# EAGLE design ReadySetNerds (EAGLE 9.6.2)
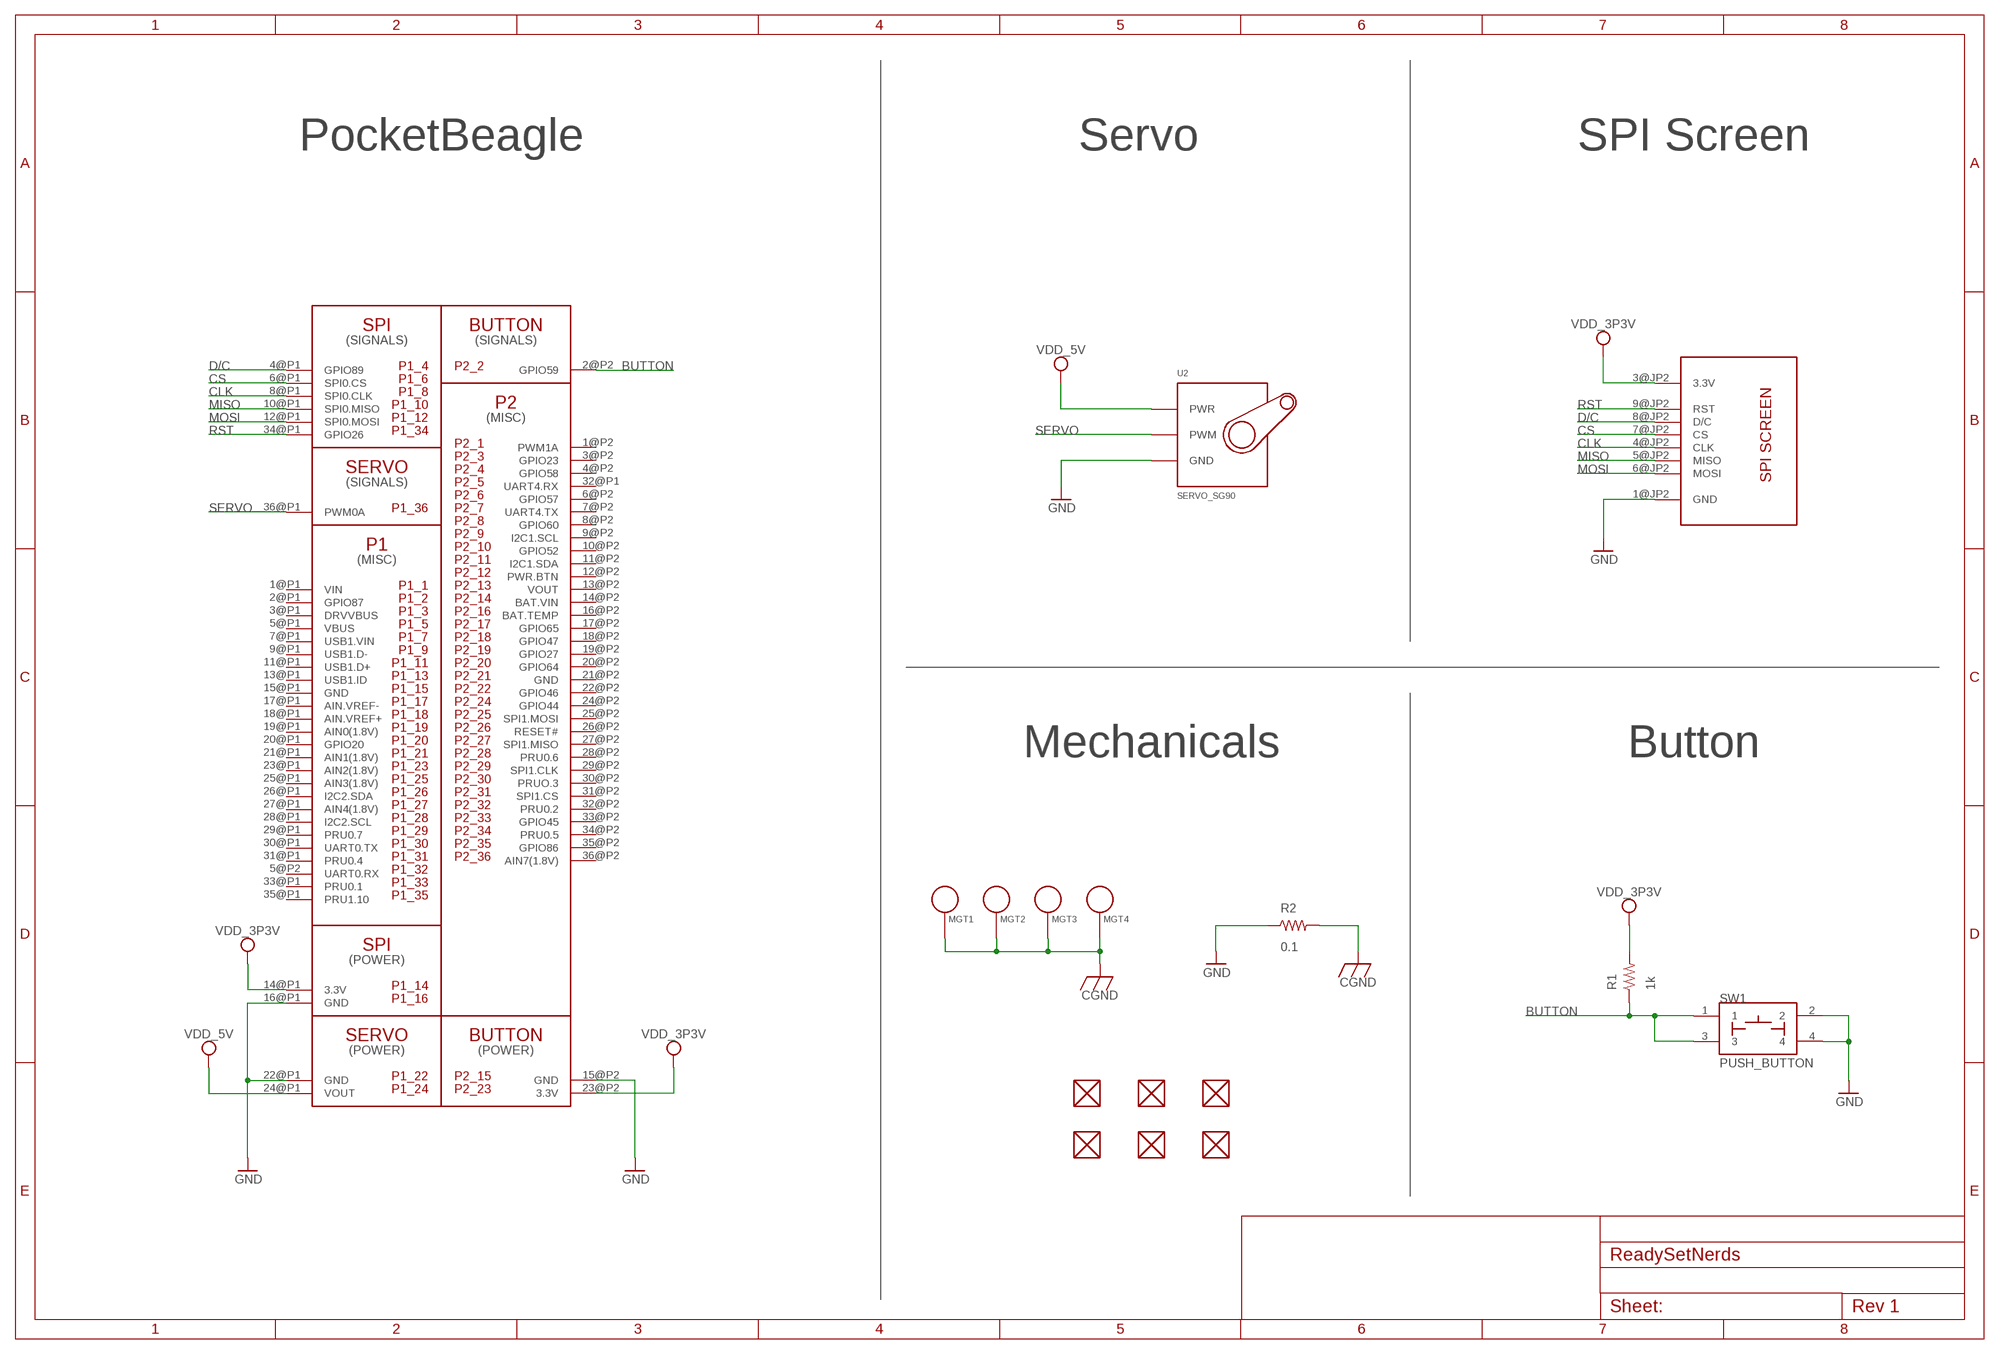
[diagram p0: schematic, sheet 1]

## Parts
FUD1  FIDUCIAL  [FIDUCIAL_40MIL]
FUD2  FIDUCIAL  [FIDUCIAL_40MIL]
FUD3  FIDUCIAL  [FIDUCIAL_40MIL]
FUD4  FIDUCIAL  [FIDUCIAL_40MIL]
FUD5  FIDUCIAL  [FIDUCIAL_40MIL]
FUD6  FIDUCIAL  [FIDUCIAL_40MIL]
MGT1  MOUNTING_HOLE  [MOUNTING_HOLE]
MGT2  MOUNTING_HOLE  [MOUNTING_HOLE]
MGT3  MOUNTING_HOLE  [MOUNTING_HOLE]
MGT4  MOUNTING_HOLE  [MOUNTING_HOLE]
R1  1k  R_R0603  [R0603]
R2  0.1  R_R0603  [R0603]
SW1  PUSH_BUTTON  [BUTTON_12.5MM]
U2  SERVO_SG90  [SERVO-X1]
U$1  POCKETBEAGLE  [POCKETBEAGLE]
U$2  SPISCREEN  [SPISCREEN]

## Nets
BUTTON: R1.1 SW1.1 SW1.3 U$1.2@P2(GPIO59)
CGND: MGT1.P$1 MGT2.P$1 MGT3.P$1 MGT4.P$1 R2.2
CLK: U$1.8@P1(SPI0.CLK) U$2.4@JP2(CLK)
CS: U$1.6@P1(SPI0.CS) U$2.7@JP2(CS)
D/C: U$1.4@P1(GPIO89) U$2.8@JP2(D/C)
GND: R2.1 SW1.2 SW1.4 U2.GND U$1.15@P2(GND) U$1.16@P1(GND) U$1.22@P1(GND) U$2.1@JP2(GND)
MISO: U$1.10@P1(SPI0.MISO) U$2.5@JP2(MISO)
MOSI: U$1.12@P1(SPI0.MOSI) U$2.6@JP2(MOSI)
RST: U$1.34@P1(GPIO26) U$2.9@JP2(RST)
SERVO: U2.SIG(PWM) U$1.36@P1(PWM0A)
VDD_3P3V: R1.2 U$1.14@P1(3.3V) U$1.23@P2(3.3V) U$2.3@JP2(3.3V)
VDD_5V: U2.PWR U$1.24@P1(VOUT)
Unconnected: FUD1.P$1 FUD2.P$1 FUD3.P$1 FUD4.P$1 FUD5.P$1 FUD6.P$1 U$1.1@P1(VIN) U$1.1@P2(PWM1A) U$1.2@P1(GPIO87) U$1.3@P1(DRVVBUS) U$1.3@P2(GPIO23) U$1.4@P2(GPIO58) U$1.5@P1(VBUS) U$1.5@P2(UART0.RX) U$1.6@P2(GPIO57) U$1.7@P1(USB1.VIN) U$1.7@P2(UART4.TX) U$1.8@P2(GPIO60) U$1.9@P1(USB1.D-) U$1.9@P2(I2C1.SCL) U$1.10@P2(GPIO52) U$1.11@P1(USB1.D+) U$1.11@P2(I2C1.SDA) U$1.12@P2(PWR.BTN) U$1.13@P1(USB1.ID) U$1.13@P2(VOUT) U$1.14@P2(BAT.VIN) U$1.15@P1(GND) U$1.16@P2(BAT.TEMP) U$1.17@P1(AIN.VREF-) U$1.17@P2(GPIO65) U$1.18@P1(AIN.VREF+) U$1.18@P2(GPIO47) U$1.19@P1(AIN0(1.8V)) U$1.19@P2(GPIO27) U$1.20@P1(GPIO20) U$1.20@P2(GPIO64) U$1.21@P1(AIN1(1.8V)) U$1.21@P2(GND) U$1.22@P2(GPIO46) U$1.23@P1(AIN2(1.8V)) U$1.24@P2(GPIO44) U$1.25@P1(AIN3(1.8V)) U$1.25@P2(SPI1.MOSI) U$1.26@P1(I2C2.SDA) U$1.26@P2(RESET#) U$1.27@P1(AIN4(1.8V)) U$1.27@P2(SPI1.MISO) U$1.28@P1(I2C2.SCL) U$1.28@P2(PRU0.6) U$1.29@P1(PRU0.7) U$1.29@P2(SPI1.CLK) U$1.30@P1(UART0.TX) U$1.30@P2(PRUO.3) U$1.31@P1(PRU0.4) U$1.31@P2(SPI1.CS) U$1.32@P1(UART4.RX) U$1.32@P2(PRU0.2) U$1.33@P1(PRU0.1) U$1.33@P2(GPIO45) U$1.34@P2(PRU0.5) U$1.35@P1(PRU1.10) U$1.35@P2(GPIO86) U$1.36@P2(AIN7(1.8V))

## Notes on the sheet
- PocketBeagle | Servo | SPI Screen
- Mechanicals | Button

## Library data of the parts
FUD1-FUD6 = ReadySetNerds:FIDUCIAL
MGT1-MGT4 = ReadySetNerds:MOUNTING_HOLE: Chassis Mounting Hole w/GND connection ability
R1 R2 = ReadySetNerds:R_: RESISTOR, American symbol
SW1 = ReadySetNerds:PUSH_BUTTON
U2 = ReadySetNerds:SERVO_SG90
U$1 = ReadySetNerds:POCKETBEAGLE
U$2 = ReadySetNerds:SPISCREEN

## Board
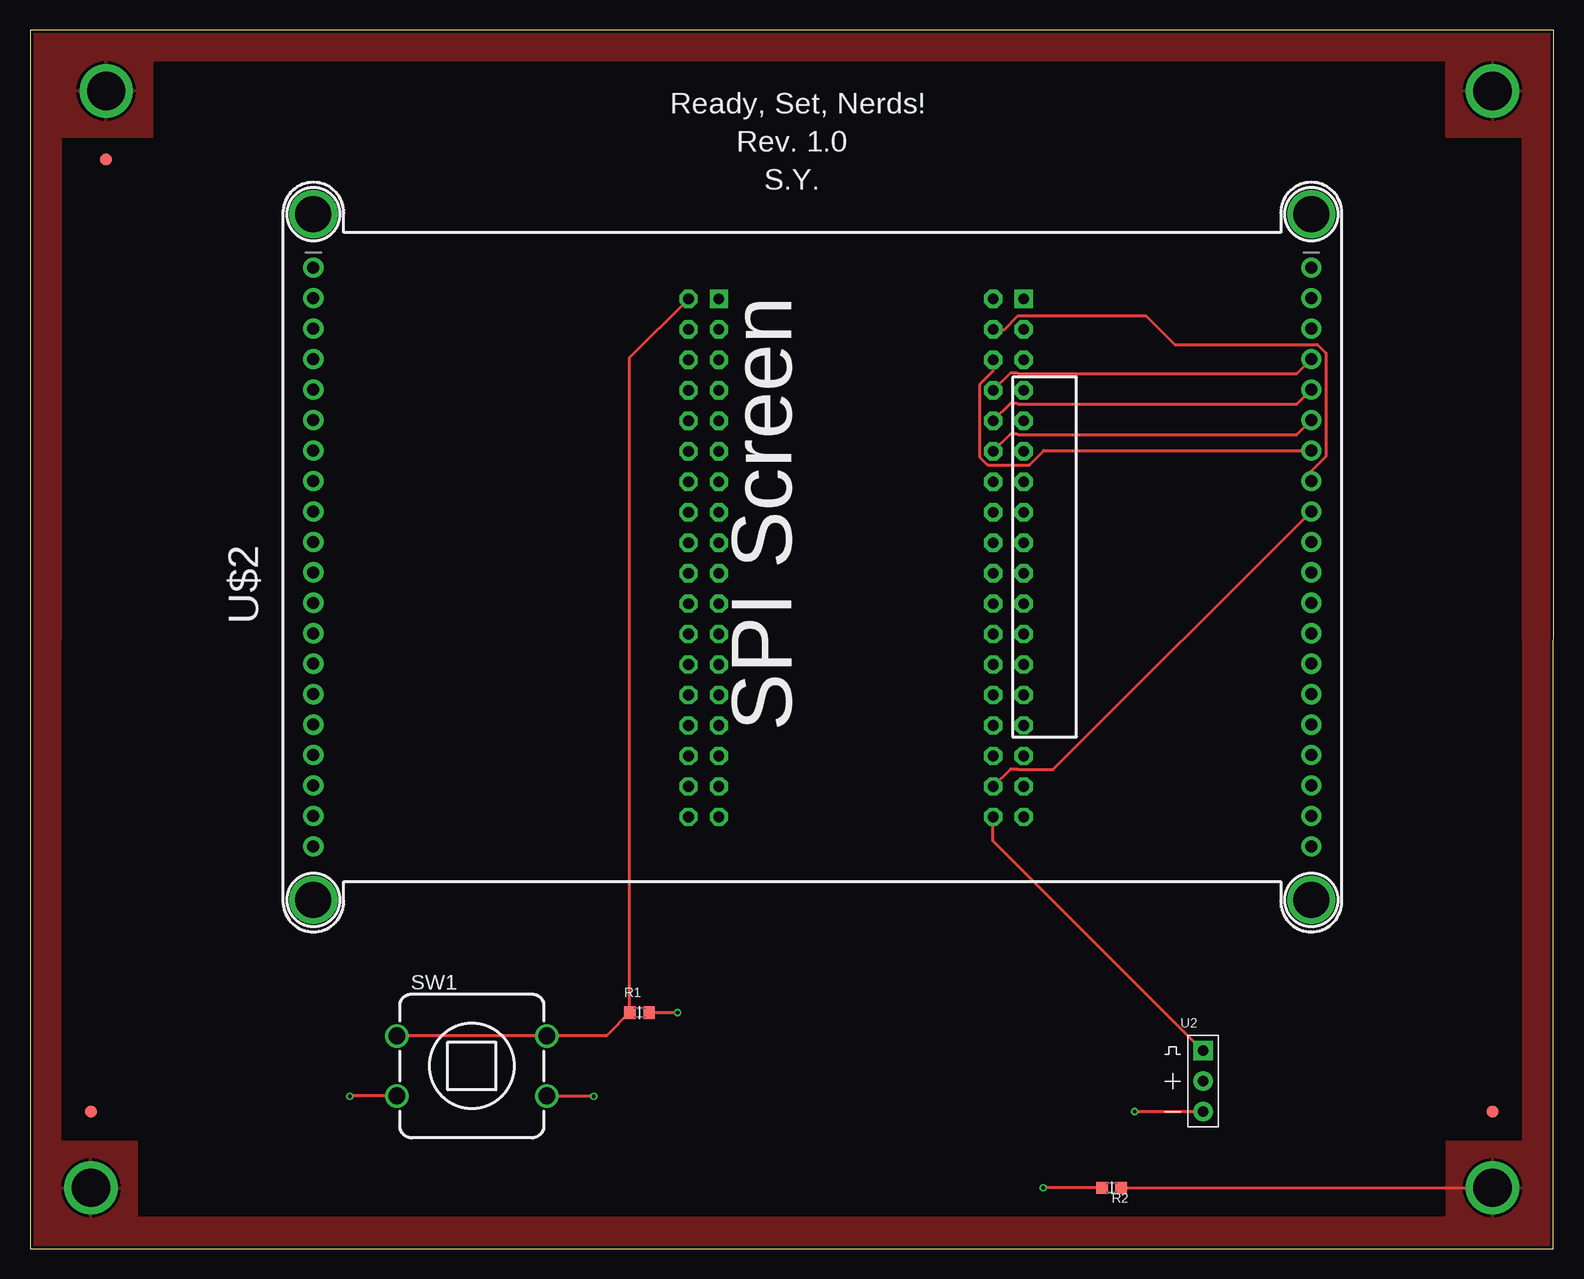
[diagram p1: board, top side]
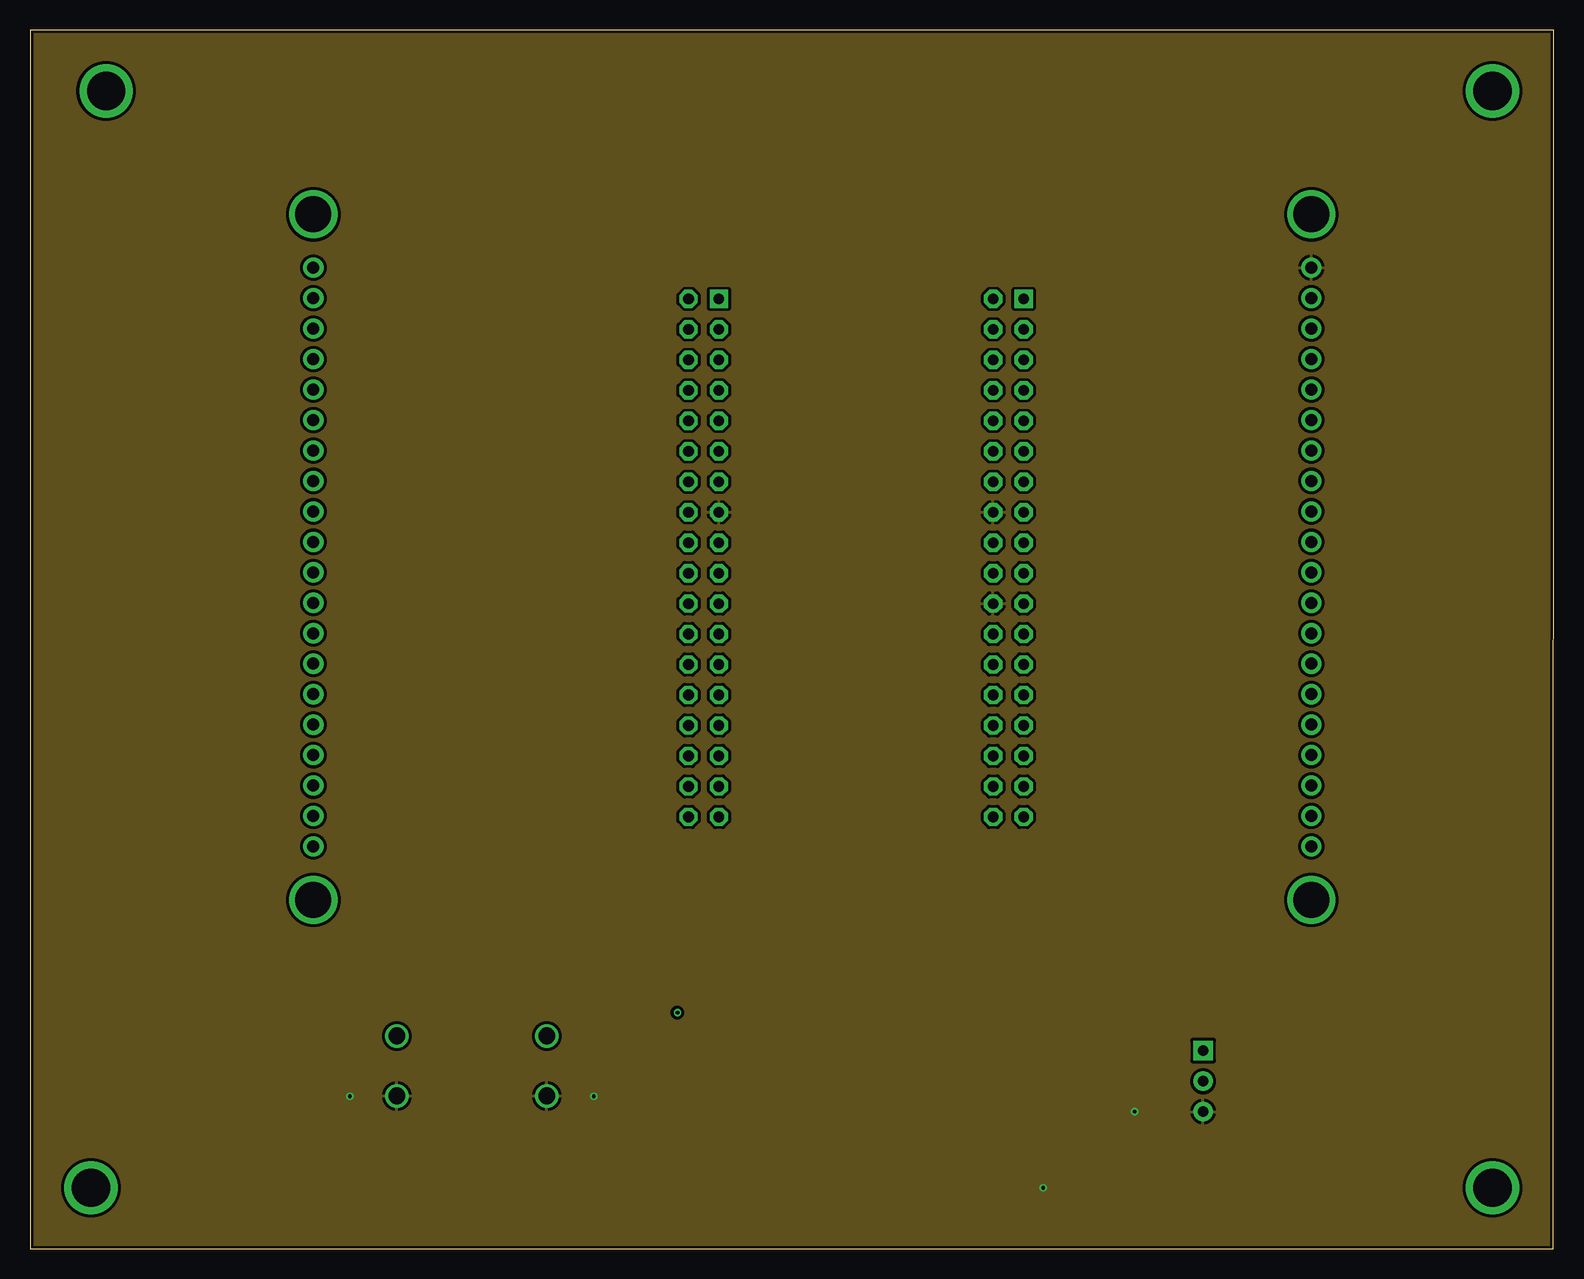
[diagram p2: board, inner layer Route2]
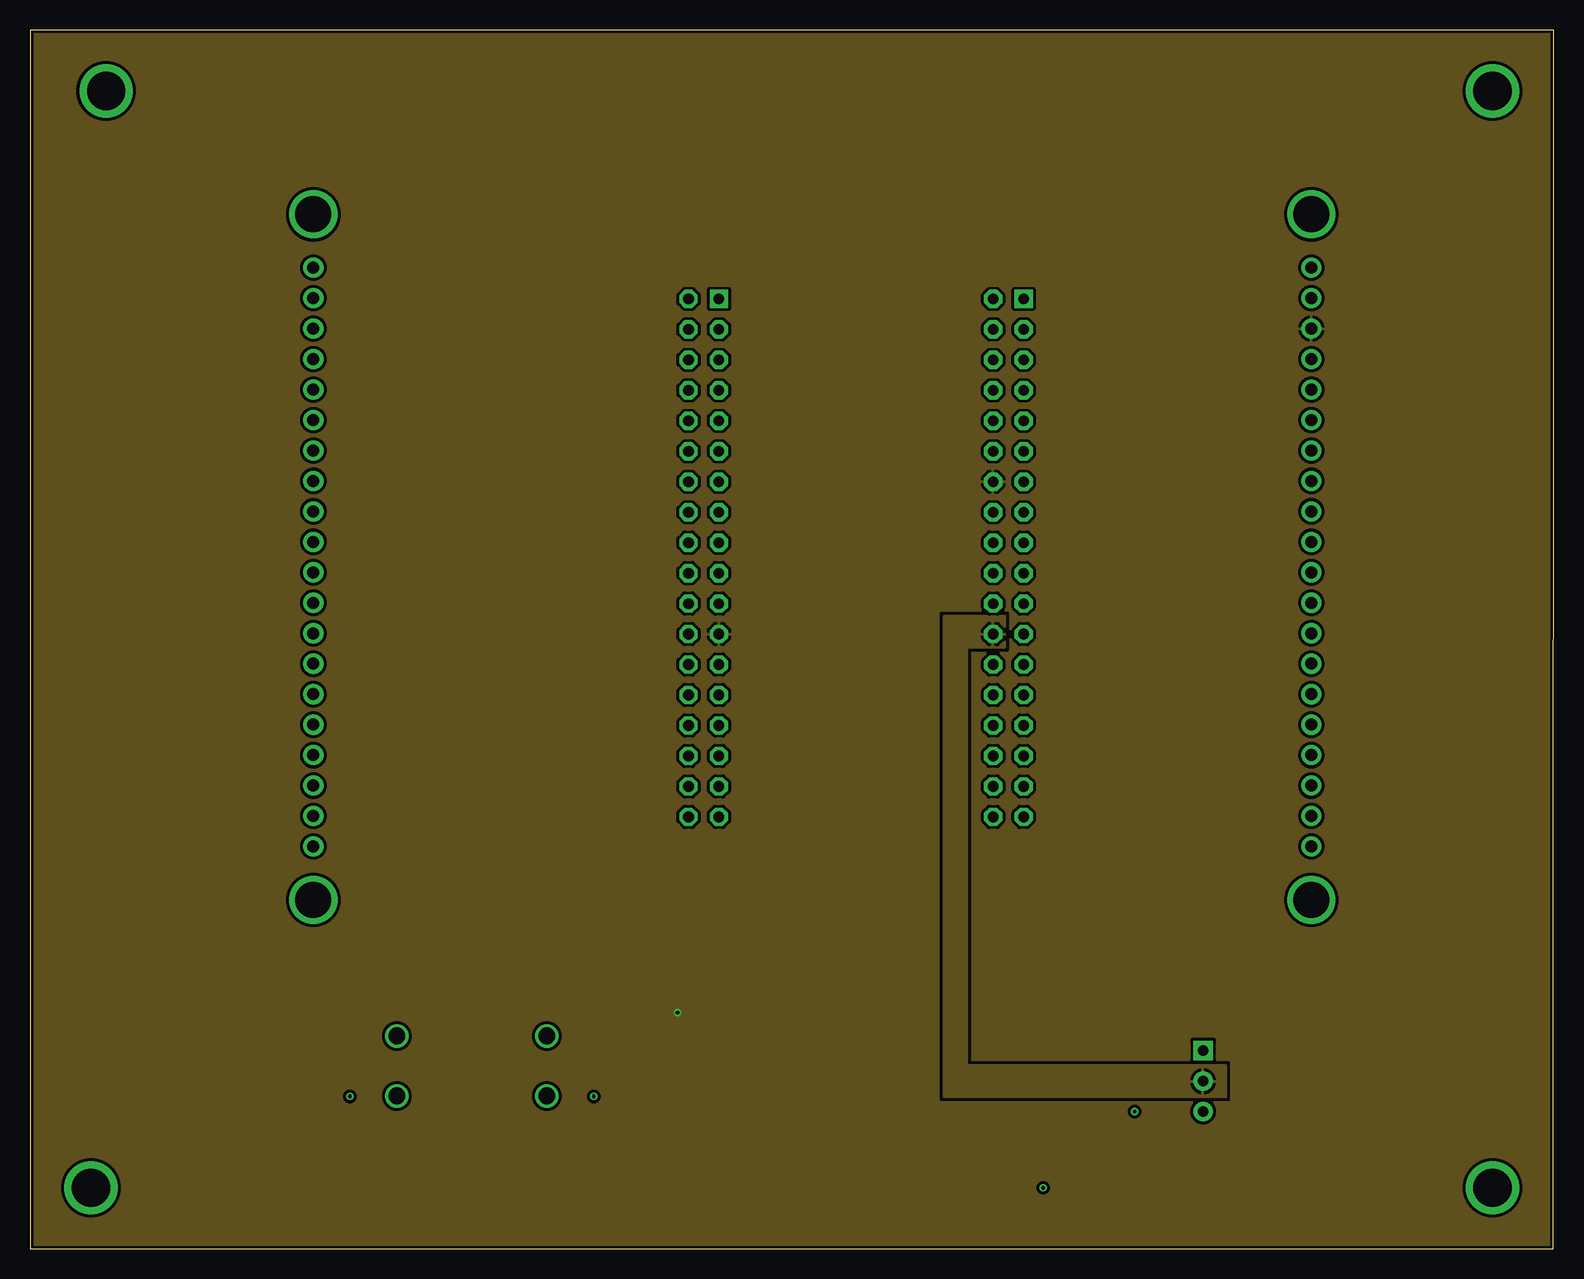
[diagram p3: board, inner layer Route15]
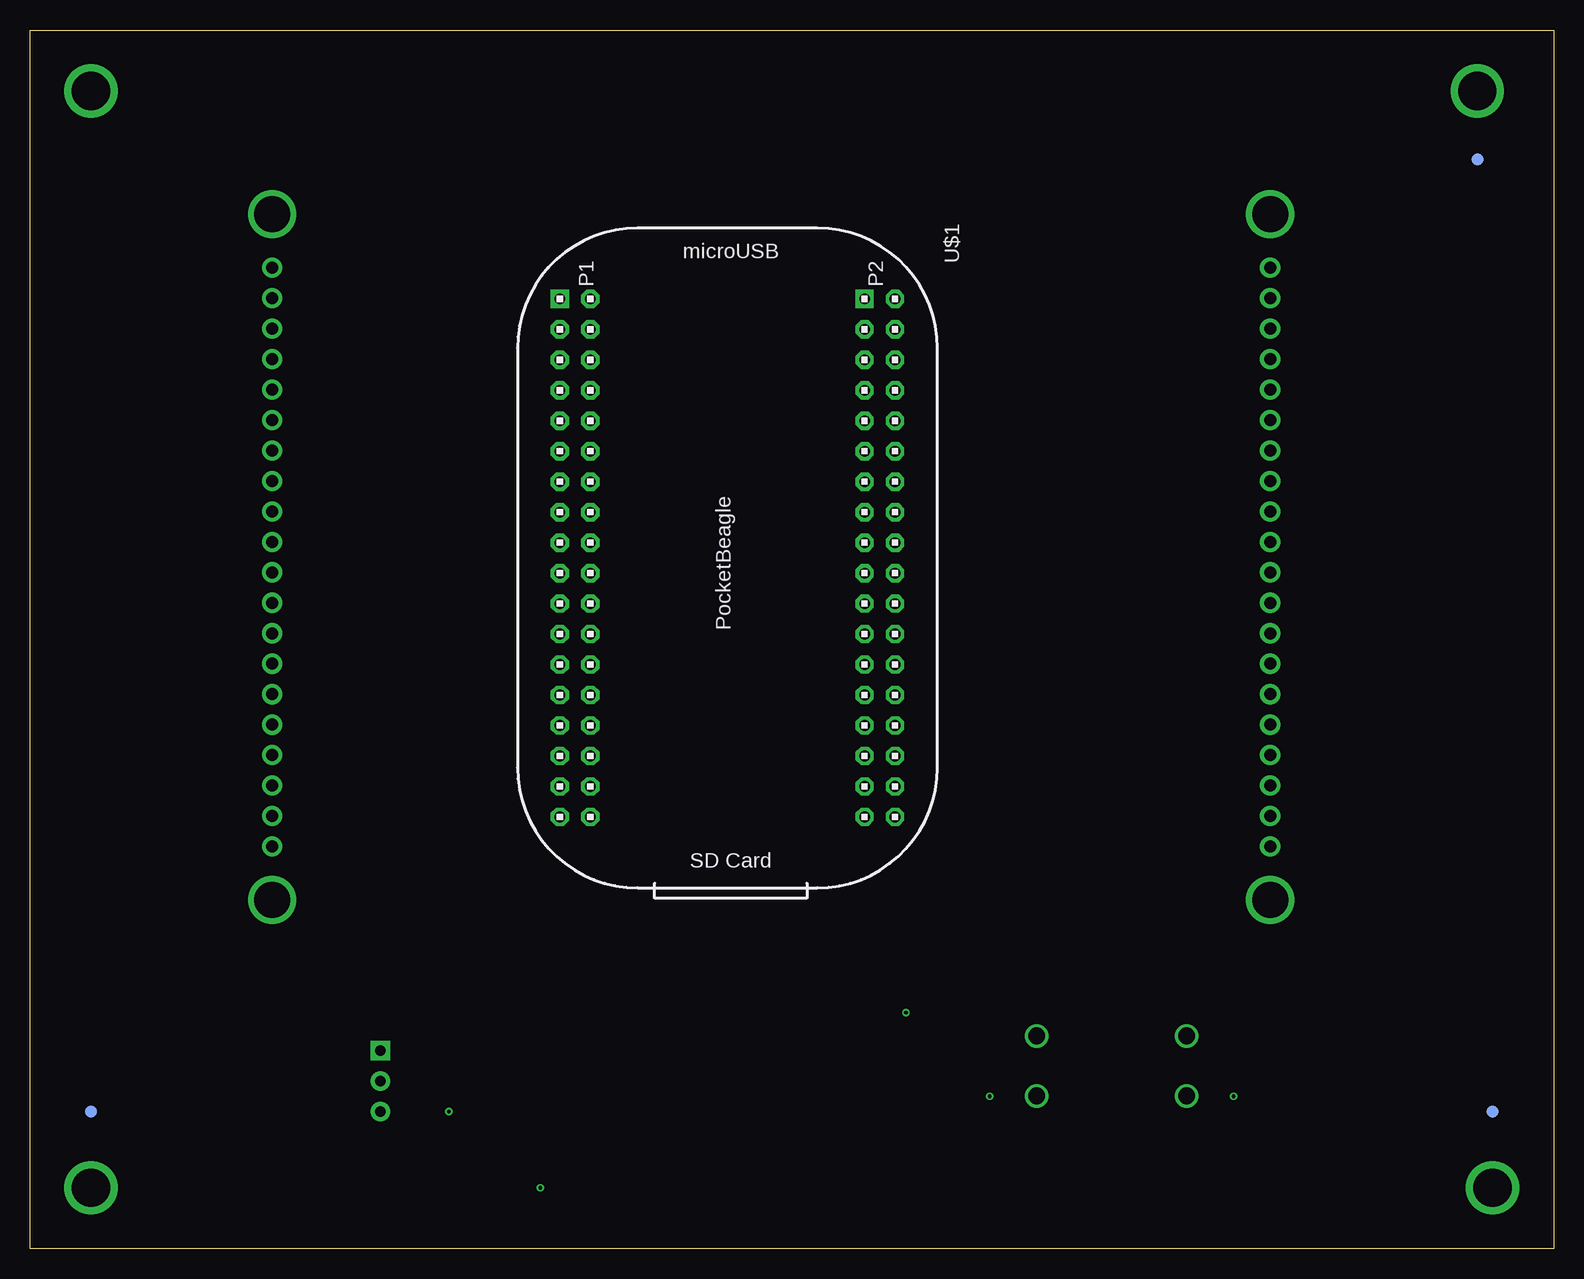
[diagram p4: board, bottom side, seen from below]

Size 127 x 101.6 mm. Coordinates in mm from the lower left corner, seen from the top.
Outline: 0,0 126.98,0 127,101.6 0,101.6 0,0
Copper layers (1*2*15*16): Top 0.035mm / dielectric 0.23mm / Route2 0.035mm / dielectric 0.93mm / Route15 0.035mm / dielectric 0.23mm / Bottom 0.035mm
Design rules "default *": minimum track width 10mil, minimum drill 12mil, track to track 10mil, track to pad 10mil, pad to pad 10mil, via to via 10mil, smd to smd 10mil, copper to edge 10mil, drill to drill 12mil, minimum pad ring 6mil, minimum via ring 6mil, stop-mask expansion 3mil, vias tented up to drill 25mil, thermal gap 10mil

### Footprints (pad centres in the part's own frame; a part is rotated, then mirrored left to right if it is on the bottom)
FIDUCIAL_40MIL = smd 1.016 x 1.016: P$1 0,0
MOUNTING_HOLE = drill 3.175 pad 4.445: P$1 0,0
R0603 = smd 0.95 x 1.031: 1 -0.8,0; 2 0.8,0
BUTTON_12.5MM = drill 1.4: 1 -6.25,2.5; 2 -6.25,-2.5; 3 6.25,2.5; 4 6.25,-2.5
SERVO-X1 = drill 0.889 pad 1.651: GND 0,-2.54; PWR 0,0 | drill 0.889 pad 1.651 square: SIG 0,2.54
POCKETBEAGLE = drill 0.889 pad 1.524 square: 1@P1 10.99,9.88; 1@P2 10.99,35.28 | drill 0.889 pad 1.524 octagon: 2@P1 10.99,12.42; 2@P2 10.99,37.82; 3@P1 13.53,9.88; 3@P2 13.53,35.28; 4@P1 13.53,12.42; 4@P2 13.53,37.82; 5@P1 16.07,9.88; 5@P2 16.07,35.28; 6@P1 16.07,12.42; 6@P2 16.07,37.82; 7@P1 18.61,9.88; 7@P2 18.61,35.28; 8@P1 18.61,12.42; 8@P2 18.61,37.82; 9@P1 21.15,9.88; 9@P2 21.15,35.28; 10@P1 21.15,12.42; 10@P2 21.15,37.82; 11@P1 23.69,9.88; 11@P2 23.69,35.28; 12@P1 23.69,12.42; 12@P2 23.69,37.82; 13@P1 26.23,9.88; 13@P2 26.23,35.28; 14@P1 26.23,12.42; 14@P2 26.23,37.82; 15@P1 28.77,9.88; 15@P2 28.77,35.28; 16@P1 28.77,12.42; 16@P2 28.77,37.82; 17@P1 31.31,9.88; 17@P2 31.31,35.28; 18@P1 31.31,12.42; 18@P2 31.31,37.82; 19@P1 33.85,9.88; 19@P2 33.85,35.28; 20@P1 33.85,12.42; 20@P2 33.85,37.82; 21@P1 36.39,9.88; 21@P2 36.39,35.28; 22@P1 36.39,12.42; 22@P2 36.39,37.82; 23@P1 38.93,9.88; 23@P2 38.93,35.28; 24@P1 38.93,12.42; 24@P2 38.93,37.82; 25@P1 41.47,9.88; 25@P2 41.47,35.28; 26@P1 41.47,12.42; 26@P2 41.47,37.82; 27@P1 44.01,9.88; 27@P2 44.01,35.28; 28@P1 44.01,12.42; 28@P2 44.01,37.82; 29@P1 46.55,9.88; 29@P2 46.55,35.28; 30@P1 46.55,12.42; 30@P2 46.55,37.82; 31@P1 49.09,9.88; 31@P2 49.09,35.28; 32@P1 49.09,12.42; 32@P2 49.09,37.82; 33@P1 51.63,9.88; 33@P2 51.63,35.28; 34@P1 51.63,12.42; 34@P2 51.63,37.82; 35@P1 54.17,9.88; 35@P2 54.17,35.28; 36@P1 54.17,12.42; 36@P2 54.17,37.82
SPISCREEN = drill 1 pad 1.676: 1@JP1 36.068,50.038; 1@JP2 36.068,-33.147; 2@JP1 33.528,50.038; 2@JP2 33.528,-33.147; 3@JP1 30.988,50.038; 3@JP2 30.988,-33.147; 4@JP1 28.448,50.038; 4@JP2 28.448,-33.147; 5@JP1 25.908,50.038; 5@JP2 25.908,-33.147; 6@JP1 23.368,50.038; 6@JP2 23.368,-33.147; 7@JP1 20.828,50.038; 7@JP2 20.828,-33.147; 8@JP1 18.288,50.038; 8@JP2 18.288,-33.147; 9@JP1 15.748,50.038; 9@JP2 15.748,-33.147; 10@JP1 13.208,50.038; 10@JP2 13.208,-33.147; 11@JP1 10.668,50.038; 11@JP2 10.668,-33.147; 12@JP1 8.128,50.038; 12@JP2 8.128,-33.147; 13@JP1 5.588,50.038; 13@JP2 5.588,-33.147; 14@JP1 3.048,50.038; 14@JP2 3.048,-33.147; 15@JP1 0.508,50.038; 15@JP2 0.508,-33.147; 16@JP1 -2.032,50.038; 16@JP2 -2.032,-33.147; 17@JP1 -4.572,50.038; 17@JP2 -4.572,-33.147; 18@JP1 -7.112,50.038; 18@JP2 -7.112,-33.147; 19@JP1 -9.652,50.038; 19@JP2 -9.652,-33.147; 20@JP1 -12.192,50.038; 20@JP2 -12.192,-33.147 | drill 3 pad 3.6: P$1@U$7 -16.637,-33.147; P$1@U$15 40.513,-33.147; P$1@U$16 -16.637,50.038; P$1@U$17 40.513,50.038

### Placement (x,y rotation side)
FUD1  6.35,90.81 0 top
FUD2  121.92,11.43 0 top
FUD3  5.08,11.43 0 top
FUD4  5.08,11.43 0 bottom
FUD5  121.92,11.43 0 bottom
FUD6  6.35,90.81 0 bottom
MGT1  5.08,5.08 0 top
MGT2  121.92,5.08 0 top
MGT3  121.92,96.52 0 top
MGT4  6.35,96.52 0 top
R1  50.8,19.68 0 top
R2  90.17,5.08 0 top
SW1  36.83,15.24 0 top
U2  97.79,13.97 0 top
U$1  92.71,90.17 270 bottom
U$2  73.66,45.72 90 top

### Tracks (layer width: path | path; a pad name or v marks a point on that pad's centre or on a via)
BUTTON
  Top 0.254: SW1.1 SW1.3 48.05,17.74 R1.1 50,74.29 U$1.2@P2
CGND
  Top 0.254: R2.2 MGT2.P$1
  pour Top: -1.27,50.8 -1.27,-1.27 128.27,-1.27 128.27,50.8 124.46,50.8 124.46,8.89 118.11,8.89 118.11,2.54 8.89,2.54 8.89,8.89 2.54,8.89 2.54,50.8
  pour Top: -1.27,50.8 -1.27,102.87 128.27,102.87 128.27,50.8 124.46,50.8 124.46,92.71 118.11,92.71 118.11,99.06 10.16,99.06 10.16,92.71 2.54,92.71 2.54,50.8 0,50.8
CLK
  Top 0.254: U$1.8@P1 81.75,73.03 82.29,73.03 82.36,72.96 105.6,72.96 U$2.4@JP2
CS
  Top 0.254: U$1.6@P1 80.29,73.18 79.15,72.03 79.15,66.01 79.82,65.34 83.3,65.34 84.51,66.55 U$2.7@JP2
D/C
  Top 0.254: U$1.4@P1 81.21,76.64 82.36,77.78 93.03,77.78 95.43,75.39 107.31,75.39 108.03,74.67 108.03,66.04 106.81,64.82 U$2.8@JP2
GND  (via drill 0.3 pad 0.61)
  Top 0.254: SW1.4 46.95,12.74 v46.99,12.7 | SW1.2 26.71,12.74 v26.67,12.7 | R2.1 v84.45,5.08 | U2.GND v92.08,11.43
  pour Route2: -2.54,-2.54 -2.54,104.14 129.54,104.14 129.54,-2.54
MISO
  Top 0.254: U$1.10@P1 81.75,70.48 82.29,70.48 82.36,70.42 105.6,70.42 U$2.5@JP2
MOSI
  Top 0.254: U$1.12@P1 81.75,67.94 82.29,67.94 82.36,67.88 105.6,67.88 U$2.6@JP2
RST
  Top 0.254: U$1.34@P1 81.75,40.01 82.29,40.01 82.36,39.94 85.28,39.94 U$2.9@JP2
SERVO
  Top 0.254: U2.SIG 80.29,34.01 U$1.36@P1
VDD_3P3V  (via drill 0.3 pad 0.61)
  Top 0.254: R1.2 v53.98,19.68
  pour Route15 (rank 6): -5.08,-5.08 -5.08,106.68 132.08,106.68 132.08,-5.08
VDD_5V
  pour Route15: 99.69,15.24 78.11,15.24 78.11,50.16 81.28,50.16 81.28,52.7 76.2,52.7 76.2,12.7 99.69,12.7

### Text on the board
tPlace: Ready, Set, Nerds! | Rev. 1.0 | S.Y.